# Altium schematic sheet TFT_MULTIFUN.SchDoc
size A4
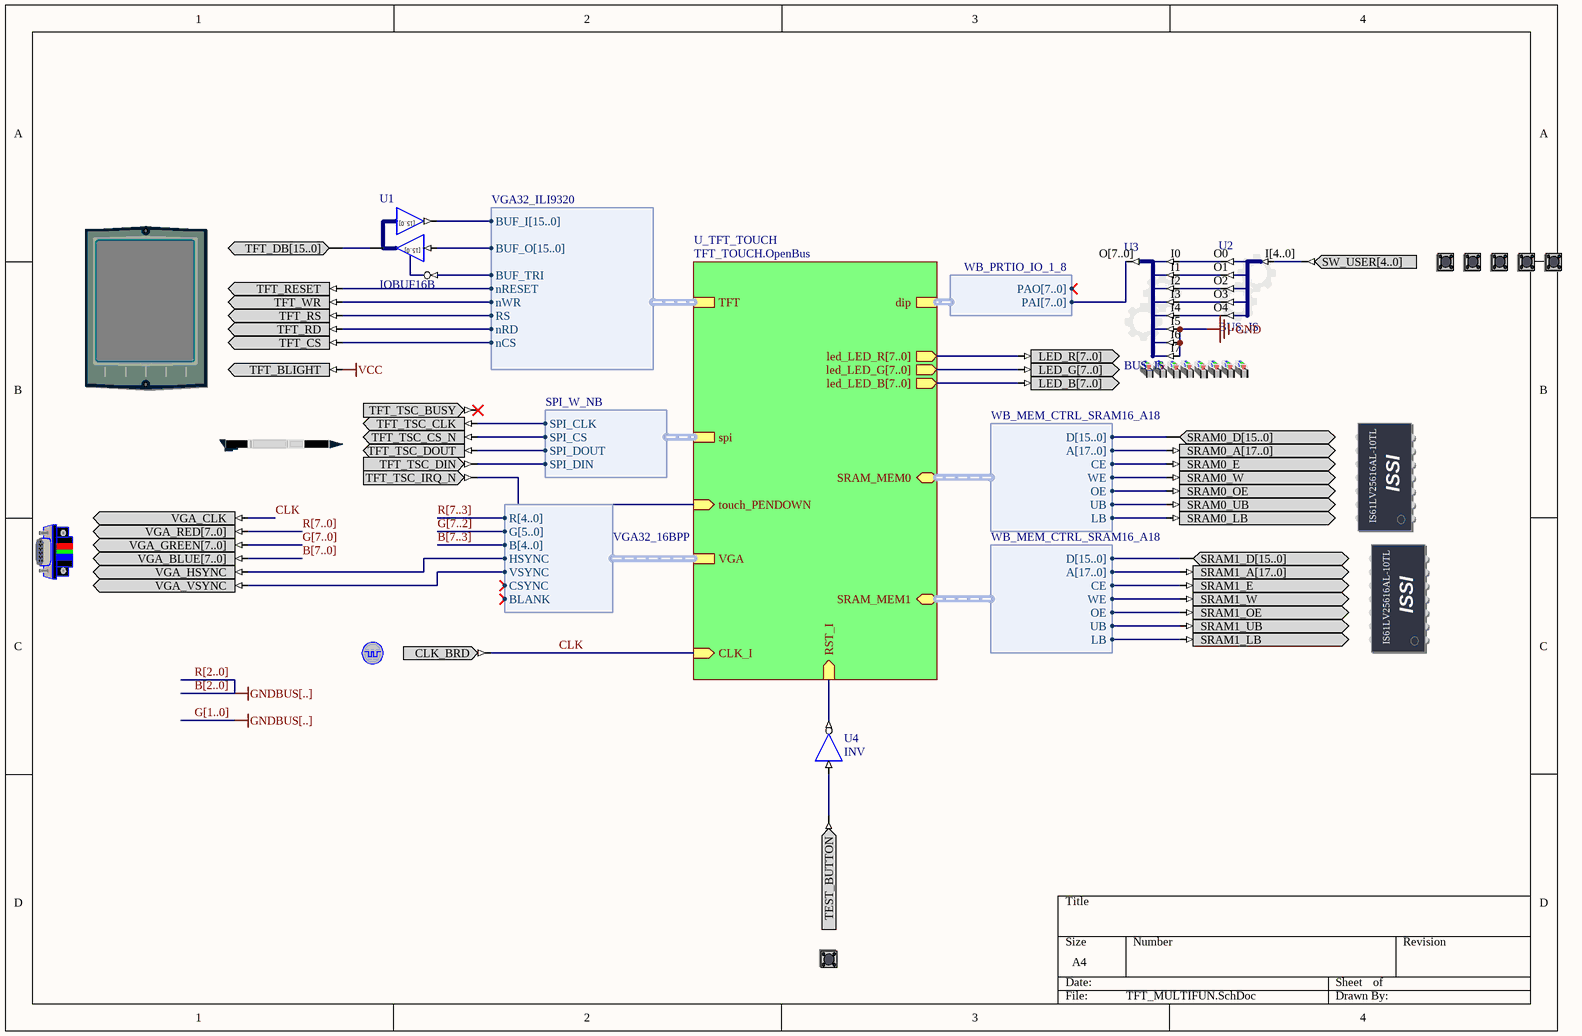
[diagram p0: TFT_MULTIFUN.SchDoc]

## Parts
(Parts that share a designator on the sheet are numbered #1, #2 ... from top to bottom, then left to right.)
?#1  TFT_LCD  (value not drawn)
?#2  USER_BUTTONS  (value not drawn)
?#3  LEDS_RGB  (value not drawn)
?#4  TOUCH_SCREEN_PEN  (value not drawn)
?#5  SRAM0  (value not drawn)
?#6  VGACNTR  (value not drawn)
?#7  SRAM1  (value not drawn)
?#8  CLOCK_BOARD  (value not drawn)
?#9  TEST_BUTTON  (value not drawn)
U1  IOBUF16B
U2  BUS_JS
U3  BUS_JS
U4  INV

## Sub-sheets
U_TFT_TOUCH = TFT_TOUCH.OpenBus: dip (harness WB_PRTIO_IO_1_8), led_LED_R[7..0] (out), led_LED_G[7..0] (out), led_LED_B[7..0] (out), touch_PENDOWN (in), spi (harness SPI_W_NB), TFT (harness VGA32_ILI9320), VGA (harness VGA32_16BPP), RST_I (in), CLK_I (in), SRAM_MEM0 (harness WB_MEM_CTRL_SRAM16_A18), SRAM_MEM1 (harness WB_MEM_CTRL_SRAM16_A18)

## Harnesses
WB_PRTIO_IO_1_8: PAO[7..0], PAI[7..0]
VGA32_ILI9320: BUF_TRI, BUF_O[15..0], BUF_I[15..0], nRESET, nWR, RS, nRD, nCS
SPI_W_NB: SPI_DOUT, SPI_DIN, SPI_CLK, SPI_CS
VGA32_16BPP: R[4..0], G[5..0], B[4..0], HSYNC, VSYNC, CSYNC, BLANK
WB_MEM_CTRL_SRAM16_A18: D[15..0], A[17..0], CE, WE, OE, UB, LB

## Nets
GND: U3.I5 U3.I6 U3.I7
VCC: ?#1.TFT_BLIGHT
B[7..0]: ?#6.VGA_BLUE[7..0]
CLK: ?#6.VGA_CLK ?#8.CLK_BRD ; sheet U_TFT_TOUCH/CLK_I
G[7..0]: ?#6.VGA_GREEN[7..0]
R[7..0]: ?#6.VGA_RED[7..0]
Net?#1_TFT_CS: ?#1.TFT_CS ; sheet U_TFT_TOUCH/TFT.nCS
Net?#1_TFT_DB[15..0]: ?#1.TFT_DB[15..0] U1.IO[15..0]
Net?#1_TFT_RD: ?#1.TFT_RD ; sheet U_TFT_TOUCH/TFT.nRD
Net?#1_TFT_RESET: ?#1.TFT_RESET ; sheet U_TFT_TOUCH/TFT.nRESET
Net?#1_TFT_RS: ?#1.TFT_RS ; sheet U_TFT_TOUCH/TFT.RS
Net?#1_TFT_WR: ?#1.TFT_WR ; sheet U_TFT_TOUCH/TFT.nWR
Net?#2_SW_USER[4..0]: ?#2.SW_USER[4..0] U2.I[4..0]
Net?#3_LED_B[7..0]: ?#3.LED_B[7..0] ; sheet U_TFT_TOUCH/led_LED_B[7..0]
Net?#3_LED_G[7..0]: ?#3.LED_G[7..0] ; sheet U_TFT_TOUCH/led_LED_G[7..0]
Net?#3_LED_R[7..0]: ?#3.LED_R[7..0] ; sheet U_TFT_TOUCH/led_LED_R[7..0]
Net?#4_TFT_TSC_CLK: ?#4.TFT_TSC_CLK ; sheet U_TFT_TOUCH/spi.SPI_CLK
Net?#4_TFT_TSC_CS_N: ?#4.TFT_TSC_CS_N ; sheet U_TFT_TOUCH/spi.SPI_CS
Net?#4_TFT_TSC_DIN: ?#4.TFT_TSC_DIN ; sheet U_TFT_TOUCH/spi.SPI_DIN
Net?#4_TFT_TSC_DOUT: ?#4.TFT_TSC_DOUT ; sheet U_TFT_TOUCH/spi.SPI_DOUT
Net?#4_TFT_TSC_IRQ_N: ?#4.TFT_TSC_IRQ_N ; sheet U_TFT_TOUCH/touch_PENDOWN
Net?#5_SRAM0_A[17..0]: ?#5.SRAM0_A[17..0] ; sheet U_TFT_TOUCH/SRAM_MEM0.A[17..0]
Net?#5_SRAM0_D[15..0]: ?#5.SRAM0_D[15..0] ; sheet U_TFT_TOUCH/SRAM_MEM0.D[15..0]
Net?#5_SRAM0_E: ?#5.SRAM0_E ; sheet U_TFT_TOUCH/SRAM_MEM0.CE
Net?#5_SRAM0_LB: ?#5.SRAM0_LB ; sheet U_TFT_TOUCH/SRAM_MEM0.LB
Net?#5_SRAM0_OE: ?#5.SRAM0_OE ; sheet U_TFT_TOUCH/SRAM_MEM0.OE
Net?#5_SRAM0_UB: ?#5.SRAM0_UB ; sheet U_TFT_TOUCH/SRAM_MEM0.UB
Net?#5_SRAM0_W: ?#5.SRAM0_W ; sheet U_TFT_TOUCH/SRAM_MEM0.WE
Net?#6_VGA_HSYNC: ?#6.VGA_HSYNC ; sheet U_TFT_TOUCH/VGA.HSYNC
Net?#6_VGA_VSYNC: ?#6.VGA_VSYNC ; sheet U_TFT_TOUCH/VGA.VSYNC
Net?#7_SRAM1_A[17..0]: ?#7.SRAM1_A[17..0] ; sheet U_TFT_TOUCH/SRAM_MEM1.A[17..0]
Net?#7_SRAM1_D[15..0]: ?#7.SRAM1_D[15..0] ; sheet U_TFT_TOUCH/SRAM_MEM1.D[15..0]
Net?#7_SRAM1_E: ?#7.SRAM1_E ; sheet U_TFT_TOUCH/SRAM_MEM1.CE
Net?#7_SRAM1_LB: ?#7.SRAM1_LB ; sheet U_TFT_TOUCH/SRAM_MEM1.LB
Net?#7_SRAM1_OE: ?#7.SRAM1_OE ; sheet U_TFT_TOUCH/SRAM_MEM1.OE
Net?#7_SRAM1_UB: ?#7.SRAM1_UB ; sheet U_TFT_TOUCH/SRAM_MEM1.UB
Net?#7_SRAM1_W: ?#7.SRAM1_W ; sheet U_TFT_TOUCH/SRAM_MEM1.WE
Net?#9_TEST_BUTTON: ?#9.TEST_BUTTON U4.I
NetU1_I[15..0]: U1.I[15..0] ; sheet U_TFT_TOUCH/TFT.BUF_O[15..0]
NetU1_O[15..0]: U1.O[15..0] ; sheet U_TFT_TOUCH/TFT.BUF_I[15..0]
NetU1_T: U1.T ; sheet U_TFT_TOUCH/TFT.BUF_TRI
NetU2_O0: U2.O0 U3.I0
NetU2_O1: U2.O1 U3.I1
NetU2_O2: U2.O2 U3.I2
NetU2_O3: U2.O3 U3.I3
NetU2_O4: U2.O4 U3.I4
NetU3_O[7..0]: U3.O[7..0] ; sheet U_TFT_TOUCH/dip.PAI[7..0]
NetU4_O: U4.O ; sheet U_TFT_TOUCH/RST_I

Not connected (* = marked no-connect by the designer): ?#4 TFT_TSC_BUSY*

## Buses and harness runs
bus B[2..0] = R[2..0]
bus B[7..0]
bus B[7..3]
bus G[1..0]
bus G[7..0]
bus G[7..2]
bus R[7..0]
bus R[7..3]

## Notes on the sheet
- (in symbol IOBUF16B) [15..0]
- (in symbol SRAM0) ISSI; IS61LV25616AL-10TL
- (in symbol SRAM1) ISSI; IS61LV25616AL-10TL

## Library data of the parts
?#1 = TFT_LCD: TFT LCD Panel; PortComponent: True; Published: 22-Jan-2007; Publisher: Altium Limited; HelpURL: https://wiki.altium.com/display/ADOH/NanoBoard+3000+-+TFT+LCD+Panel+%28with+Touch+Screen%29
?#2 = USER_BUTTONS: Generic User Buttons; PortComponent: True; Published: 16-Apr-2007; Publisher: Altium Limited; HelpURL: https://wiki.altium.com/display/ADOH/NanoBoard+3000+-+Generic+User+Switches
?#3 = LEDS_RGB: LEDS RGB; PortComponent: True; Published: 11-Mar-2009; Publisher: Altium Limited; HelpURL: https://wiki.altium.com/display/ADOH/NanoBoard+3000+-+RGB+User+LEDs
?#4 = TFT_PEN: Touch Screen Pen Control; PortComponent: True; Published: 22-Jan-2007; Publisher: Altium Limited; HelpURL: https://wiki.altium.com/display/ADOH/NanoBoard+3000+-+TFT+LCD+Panel+%28with+Touch+Screen%29
?#5 = SRAM0: Free Static RAM - Daughterboard; PortComponent: True; Published: 14-May-2007; Publisher: Altium Limited; HelpURL: https://wiki.altium.com/display/ADOH/NanoBoard+3000+-+Independent+SRAM
?#6 = VGACNTR: VGA Dsub-15-Female-HD; PortComponent: True; Published: 14-May-2007; Publisher: Altium Limited; HelpURL: https://wiki.altium.com/display/ADOH/NanoBoard+3000+-+Video+Output
?#7 = SRAM1: Free Static RAM - Daughterboard; PortComponent: True; Published: 14-May-2007; Publisher: Altium Limited; HelpURL: https://wiki.altium.com/display/ADOH/NanoBoard+3000+-+Independent+SRAM
?#8 = CLOCK_BOARD: Global System Clock Supply; PortComponent: True; Published: 19-Nov-2003; Publisher: Altium Limited; HelpURL: https://wiki.altium.com/display/ADOH/NanoBoard+3000+-+System+Clocks; UseInDSF: True
?#9 = TEST_BUTTON: Test / Reset Button; PortComponent: True; Published: 19-Nov-2003; Publisher: Altium Limited; HelpURL: https://wiki.altium.com/display/ADOH/NanoBoard+3000+-+Test-Reset+Button
U1 = IOBUF16B: 16-Bit Input/Output Buffer, Bus Version; SubClass: IOBUF; Enable: Low; Control: Common Control T; PortSize: 16; ArchiveName: GENERIC; VHDLIB_SIM: GENERIC_LIB; Published: 29-Jan-2004; Publisher: Altium Limited; LastRevisionNo: 1.00.00; HelpURL: CR0118 FPGA Generic Library Guide.pdf#page=293; ComponentLink1URL: CR0125 FPGA Buffer Resource Usage.pdf#page=91; ComponentLink1Description: Core &Resource Usage; FunctionalClass: Buffer; PortStyle: Bus Version
U2 = BUS_JS: Configurable Bus Joiner/Splitter; ConfiguratorName: GENERIC_BUS_JS; ConfigurationParameters: {}Version[1.1]{}SplitterJoinerType[Splitter]{}SignalCount[5]{}SignalWidth0[1]{}GapBelow0[1000000]{}ConnectionType0[Pin]{}SignalWidth1[1]{}GapBelow1[1000000]{}ConnectionType1[Pin]{}SignalWidth2[1]{}GapBelow2[1000000]{}ConnectionType2[Pin]{}SignalWidth3[1]{}GapBelow3[1000000]{}ConnectionType3[Pin]{}SignalWidth4[1]{}GapBelow4[1000000]{}ConnectionType4[Pin]{}ShowPinNames[True]{}; LastRevisionNo: 1.00.00; Published: 17-Sep-2008; Publisher: Altium Limited; HelpURL: https://wiki.altium.com/display/ADOH/Configurable+Generic+Library
U3 = BUS_JS: Configurable Bus Joiner/Splitter; ConfiguratorName: GENERIC_BUS_JS; ConfigurationParameters: {}Version[1.1]{}SplitterJoinerType[Joiner]{}SignalCount[8]{}SignalWidth0[1]{}GapBelow0[1000000]{}ConnectionType0[Pin]{}SignalWidth1[1]{}GapBelow1[1000000]{}ConnectionType1[Pin]{}SignalWidth2[1]{}GapBelow2[1000000]{}ConnectionType2[Pin]{}SignalWidth3[1]{}GapBelow3[1000000]{}ConnectionType3[Pin]{}SignalWidth4[1]{}GapBelow4[1000000]{}ConnectionType4[Pin]{}SignalWidth5[1]{}GapBelow5[1000000]{}ConnectionType5[Pin]{}SignalWidth6[1]{}GapBelow6[1000000]{}ConnectionType6[Pin]{}SignalWidth7[1]{}GapBelow7[1000000]{}ConnectionType7[Pin]{}ShowPinNames[True]{}; LastRevisionNo: 1.00.00; Published: 17-Sep-2008; Publisher: Altium Limited; HelpURL: https://wiki.altium.com/display/ADOH/Configurable+Generic+Library
U4 = INV: Inverter; FunctionalClass: Logic Primitive; ArchiveName: GENERIC; VHDLIB_SIM: GENERIC_LIB; Published: 29-Jan-2004; Publisher: Altium Limited; XilinxEquivalent: INV; LastRevisionNo: 1.00.00; HelpURL: CR0118 FPGA Generic Library Guide.pdf#page=291; ComponentLink1URL: CR0136 FPGA Logic Primitive Resource Usage.pdf#page=61; ComponentLink1Description: Core &Resource Usage; SubClass: INV